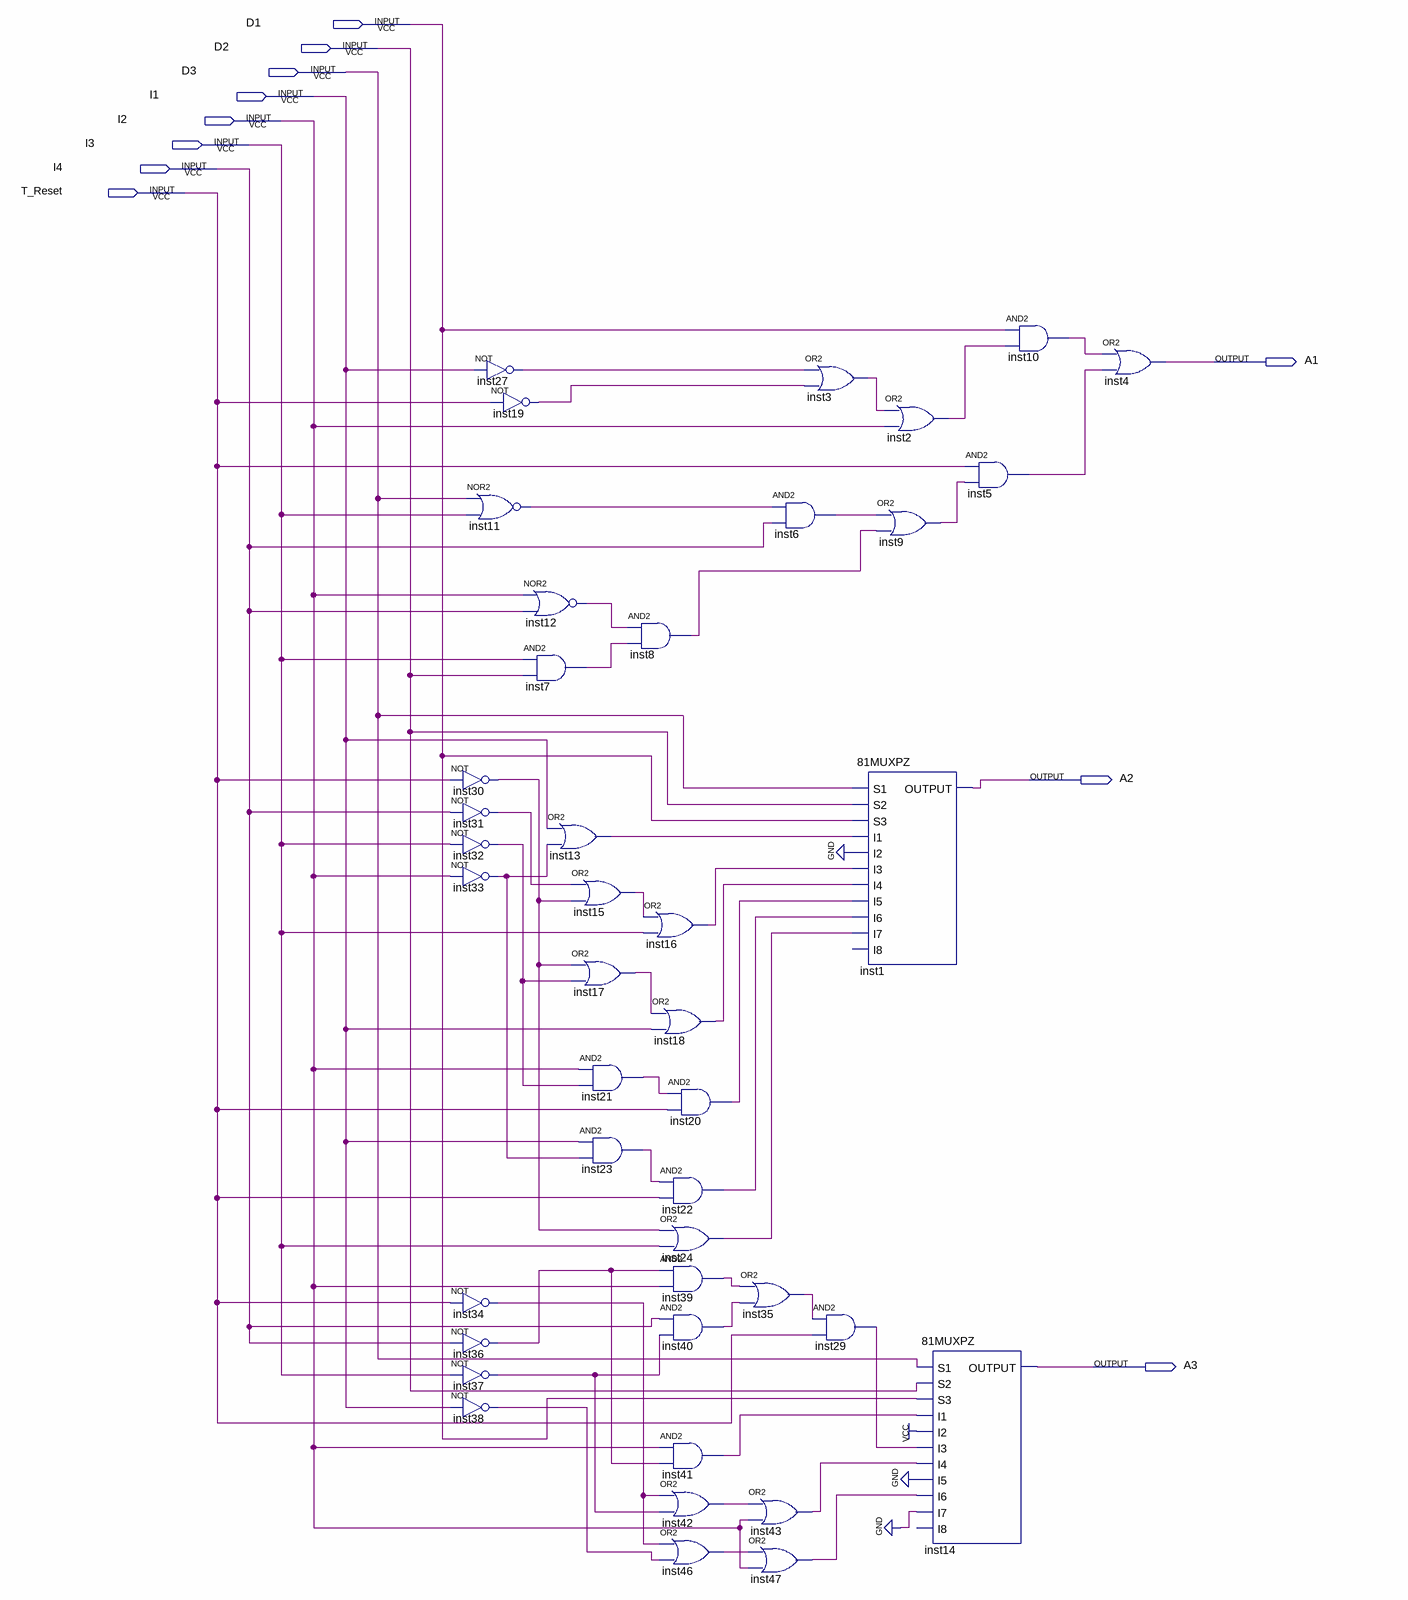
[diagram p0: schematic sheet]
// Quartus schematic NextStates.bdf as structural Verilog: 42 symbols, 11 pins
module NextStates (
  input  D1,
  input  D2,
  input  D3,
  input  I1,
  input  I2,
  input  I3,
  input  I4,
  input  T_Reset,
  output A1,
  output A2,
  output A3
);

  wire inst2_out, inst3_out, inst5_out, inst6_out, inst7_out, inst8_out, inst9_out, inst10_out, inst11_out,
       inst12_out, inst13_out, inst15_out, inst16_out, inst17_out, inst18_out, inst19_out, inst20_out,
       inst21_out, inst22_out, inst23_out, inst24_out, inst27_out, inst29_out, inst30_out, inst31_out,
       inst32_out, inst33_out, inst34_out, inst35_out, inst36_out, inst37_out, inst38_out, inst39_out,
       inst40_out, inst41_out, inst42_out, inst43_out, inst46_out, inst47_out;

  not inst30 (inst30_out, T_Reset);
  not inst31 (inst31_out, I4);
  not inst32 (inst32_out, I3);
  not inst33 (inst33_out, I2);
  not inst34 (inst34_out, T_Reset);
  not inst36 (inst36_out, I4);
  not inst37 (inst37_out, I3);
  not inst38 (inst38_out, I1);
  not inst27 (inst27_out, I1);
  not inst19 (inst19_out, T_Reset);
  nor inst11 (inst11_out, D3, I3);
  nor inst12 (inst12_out, I2, I4);
  and inst7 (inst7_out, I3, D2);
  or inst13 (inst13_out, I1, inst33_out);
  or inst15 (inst15_out, inst31_out, inst30_out);
  or inst17 (inst17_out, inst30_out, inst32_out);
  and inst21 (inst21_out, I2, inst32_out);
  and inst23 (inst23_out, I1, inst33_out);
  and inst8 (inst8_out, inst12_out, inst7_out);
  or inst16 (inst16_out, inst15_out, I3);
  or inst18 (inst18_out, inst17_out, I1);
  and inst20 (inst20_out, inst21_out, T_Reset);
  and inst22 (inst22_out, inst23_out, T_Reset);
  or inst24 (inst24_out, inst30_out, I3);
  and inst39 (inst39_out, inst36_out, I2);
  and inst40 (inst40_out, I4, inst37_out);
  and inst41 (inst41_out, I2, inst36_out);
  or inst42 (inst42_out, inst34_out, inst37_out);
  or inst46 (inst46_out, inst34_out, inst38_out);
  and inst6 (inst6_out, inst11_out, I4);
  or inst35 (inst35_out, inst39_out, inst40_out);
  or inst43 (inst43_out, inst42_out, I2);
  or inst47 (inst47_out, inst46_out, I2);
  or inst3 (inst3_out, inst27_out, inst19_out);
  and inst29 (inst29_out, inst35_out, T_Reset);
  or inst2 (inst2_out, inst3_out, I2);
  or inst9 (inst9_out, inst6_out, inst8_out);
  \81MUXPZ  inst1 (
    .S1(D3), .S2(D2), .S3(D1), .I1(inst13_out), .I2(1'b0), .I3(inst16_out), .I4(inst18_out), .I5(inst20_out),
    .I6(inst22_out), .I7(inst24_out), .OUTPUT(A2));  // open: I8
  and inst5 (inst5_out, T_Reset, inst9_out);
  \81MUXPZ  inst14 (
    .S1(D3), .S2(D2), .S3(D1), .I1(inst41_out), .I2(1'b1), .I3(inst29_out), .I4(inst43_out), .I5(1'b0),
    .I6(inst47_out), .I7(1'b0), .OUTPUT(A3));  // open: I8
  and inst10 (inst10_out, D1, inst2_out);
  or inst4 (A1, inst10_out, inst5_out);
endmodule
